# EAGLE design tb_project_ir_blaster_maxi_wemos_revA (EAGLE 7.6.0)
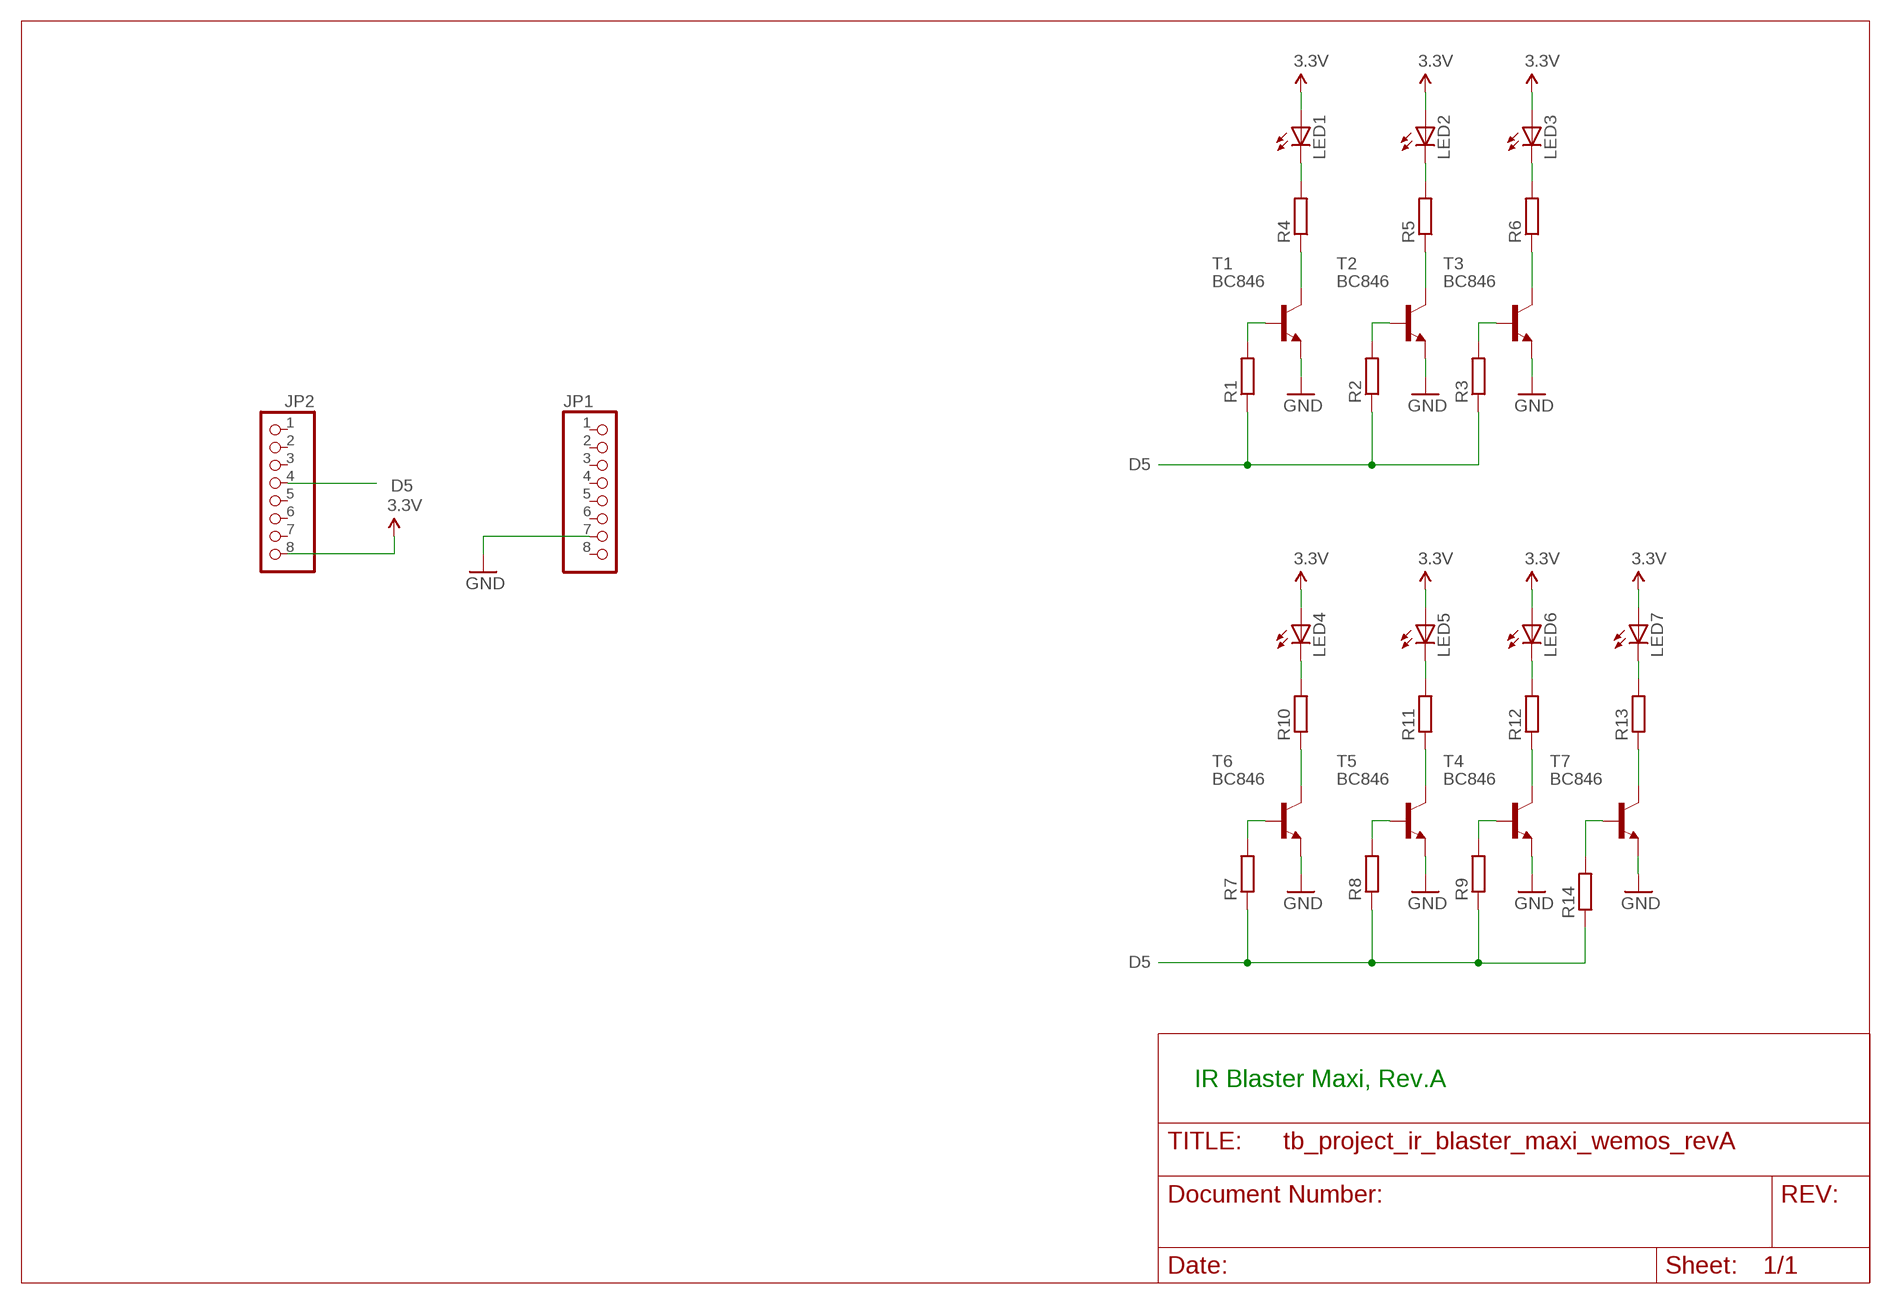
[diagram p0: schematic, sheet 1]

## Parts
JP1  PINHD-1X8  [1X08]
JP2  PINHD-1X8  [1X08]
LED1  LED5MM  [LED5MM]
LED2  LED5MM  [LED5MM]
LED3  LED5MM  [LED5MM]
LED4  LED5MM  [LED5MM]
LED5  LED5MM  [LED5MM]
LED6  LED5MM  [LED5MM]
LED7  LED5MM  [LED5MM]
R1  R-EU_R1206  [R1206]
R2  R-EU_R1206  [R1206]
R3  R-EU_R1206  [R1206]
R4  R-EU_R1206  [R1206]
R5  R-EU_R1206  [R1206]
R6  R-EU_R1206  [R1206]
R7  R-EU_R1206  [R1206]
R8  R-EU_R1206  [R1206]
R9  R-EU_R1206  [R1206]
R10  R-EU_R1206  [R1206]
R11  R-EU_R1206  [R1206]
R12  R-EU_R1206  [R1206]
R13  R-EU_R1206  [R1206]
R14  R-EU_R1206  [R1206]
T1  BC846  [SOT23]
T2  BC846  [SOT23]
T3  BC846  [SOT23]
T4  BC846  [SOT23]
T5  BC846  [SOT23]
T6  BC846  [SOT23]
T7  BC846  [SOT23]

## Nets
3.3V: JP2.8 LED1.A LED2.A LED3.A LED4.A LED5.A LED6.A LED7.A
D5: JP2.4 R1.1 R2.1 R3.1 R7.1 R8.1 R9.1 R14.1
GND: JP1.7 T1.2(E) T2.2(E) T3.2(E) T4.2(E) T5.2(E) T6.2(E) T7.2(E)
N$1: LED4.K(C) R10.2
N$2: LED1.K(C) R4.2
N$3: LED2.K(C) R5.2
N$4: LED3.K(C) R6.2
N$5: R4.1 T1.3(C)
N$6: R5.1 T2.3(C)
N$7: R6.1 T3.3(C)
N$8: R1.2 T1.1(B)
N$9: R2.2 T2.1(B)
N$10: R3.2 T3.1(B)
N$11: LED5.K(C) R11.2
N$12: LED6.K(C) R12.2
N$13: R10.1 T6.3(C)
N$14: R11.1 T5.3(C)
N$15: R12.1 T4.3(C)
N$16: R7.2 T6.1(B)
N$17: R8.2 T5.1(B)
N$18: R9.2 T4.1(B)
N$19: LED7.K(C) R13.2
N$20: R13.1 T7.3(C)
N$21: R14.2 T7.1(B)
Unconnected: JP1.1 JP1.2 JP1.3 JP1.4 JP1.5 JP1.6 JP1.8 JP2.1 JP2.2 JP2.3 JP2.5 JP2.6 JP2.7

## Notes on the sheet
- IR Blaster Maxi, Rev.A

## Library data of the parts
JP1 JP2 = pinhead:PINHD-1X8: PIN HEADER
LED1-LED7 = led:LED: LED OSRAM: - CHIPLED LG R971, LG N971, LY N971, LG Q971, LY Q971, LO R971, LY R971 LH N974, LH R974 LS Q976, LO Q976, LY Q976 LO Q996 - Hyper CHIPLED LW Q18S LB Q993, LB Q99A, LB R99A - SideLED LS A670, LO A670, LY A670, LG A670, LP A670 LB A673, LV A673, LT A673, LW A673 LH A674 LY A675 LS A676, LA A676, LO A676, LY A676, LW A676 LS A679, LY A679, LG A679 - Hyper Micro SIDELED® LS Y876, LA Y876, LO Y876, LY Y876 LT Y87S - SmartLED LW L88C, LW L88S LB L89C, LB L89S, LG L890 LS L89K, LO L89K, LY L89K LS L896, LA L896, LO L896, LY L896 - TOPLED LS T670, LO T670, LY T670, LG T670, LP T670 LSG T670, LSP T670, LSY T670, LOP T670, LYG T670 LG T671, LOG T671, LSG T671 LB T673, LV T673, LT T673, LW T673 LH T674 LS T676, LA T676, LO T676, LY T676, LB T676, LH T676, LSB T676, LW T676 LB T67C, LV T67C, LT T67C, LS T67K, LO T67K, LY T67K, LW E67C LS E67B, LA E67B, LO E67B, LY E67B, LB E67C, LV E67C, LT E67C LW T67C LS T679, LY T679, LG T679 LS T770, LO T770, LY T770, LG T770, LP T770 LB T773, LV T773, LT T773, LW T773 LH T774 LS E675, LA E675, LY E675, LS T675 LS T776, LA T776, LO T776, LY T776, LB T776 LHGB T686 LT T68C, LB T68C - Hyper Mini TOPLED® LB M676 - Mini TOPLED Santana® LG M470 LS M47K, LO M47K, LY M47K Source: http://www.osram.convergy.de LUXEON: - LUMILED® LXK2-PW12-R00, LXK2-PW12-S00, LXK2-PW14-U00, LXK2-PW14-V00 LXK2-PM12-R00, LXK2-PM12-S00, LXK2-PM14-U00 LXK2-PE12-Q00, LXK2-PE12-R00, LXK2-PE12-S00, LXK2-PE14-T00, LXK2-PE14-U00 LXK2-PB12-K00, LXK2-PB12-L00, LXK2-PB12-M00, LXK2-PB14-N00, LXK2-PB14-P00, LXK2-PB14-Q00 LXK2-PR12-L00, LXK2-PR12-M00, LXK2-PR14-Q00, LXK2-PR14-R00 LXK2-PD12-Q00, LXK2-PD12-R00, LXK2-PD12-S00 LXK2-PH12-R00, LXK2-PH12-S00 LXK2-PL12-P00, LXK2-PL12-Q00, LXK2-PL12-R00 Source: www.luxeon.com KINGBRIGHT: KA-3528ASYC Source: www.kingbright.com
R1-R14 = resistor:R-EU_: RESISTOR, European symbol
T1-T7 = transistor-neu-to92:BC846: NPN TRANSISTOR

## Net classes
0 default: width 0.203 mm, drill 0.356 mm, clearance 0.152 mm

## Board
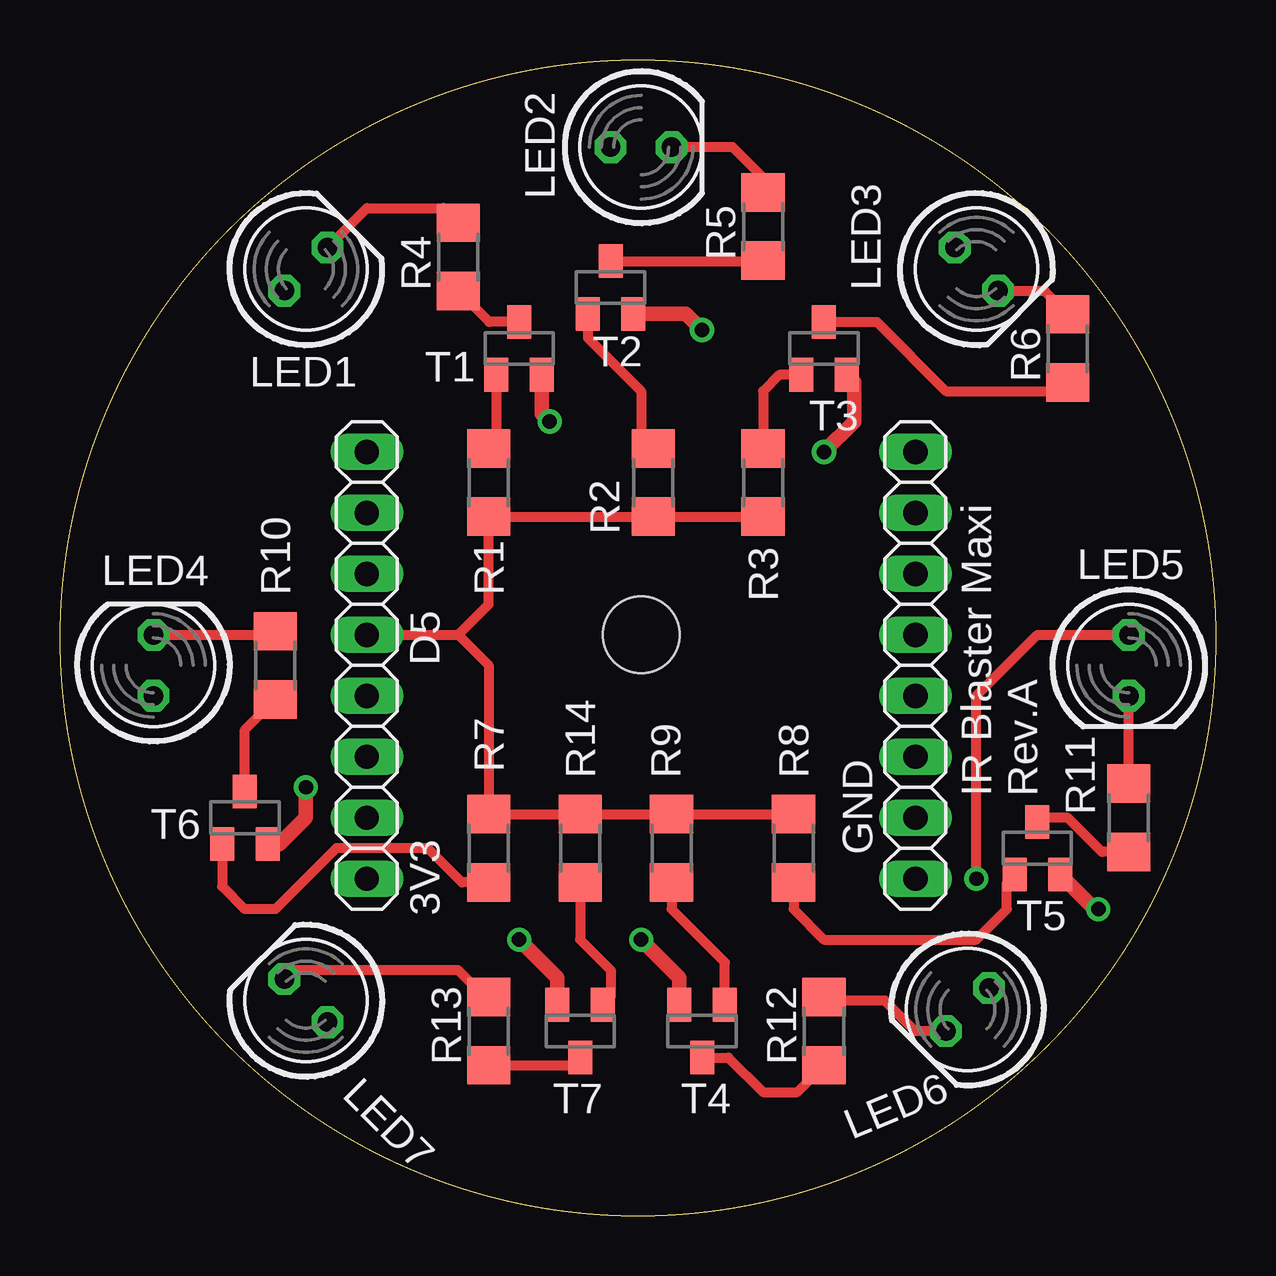
[diagram p1: board, top side]
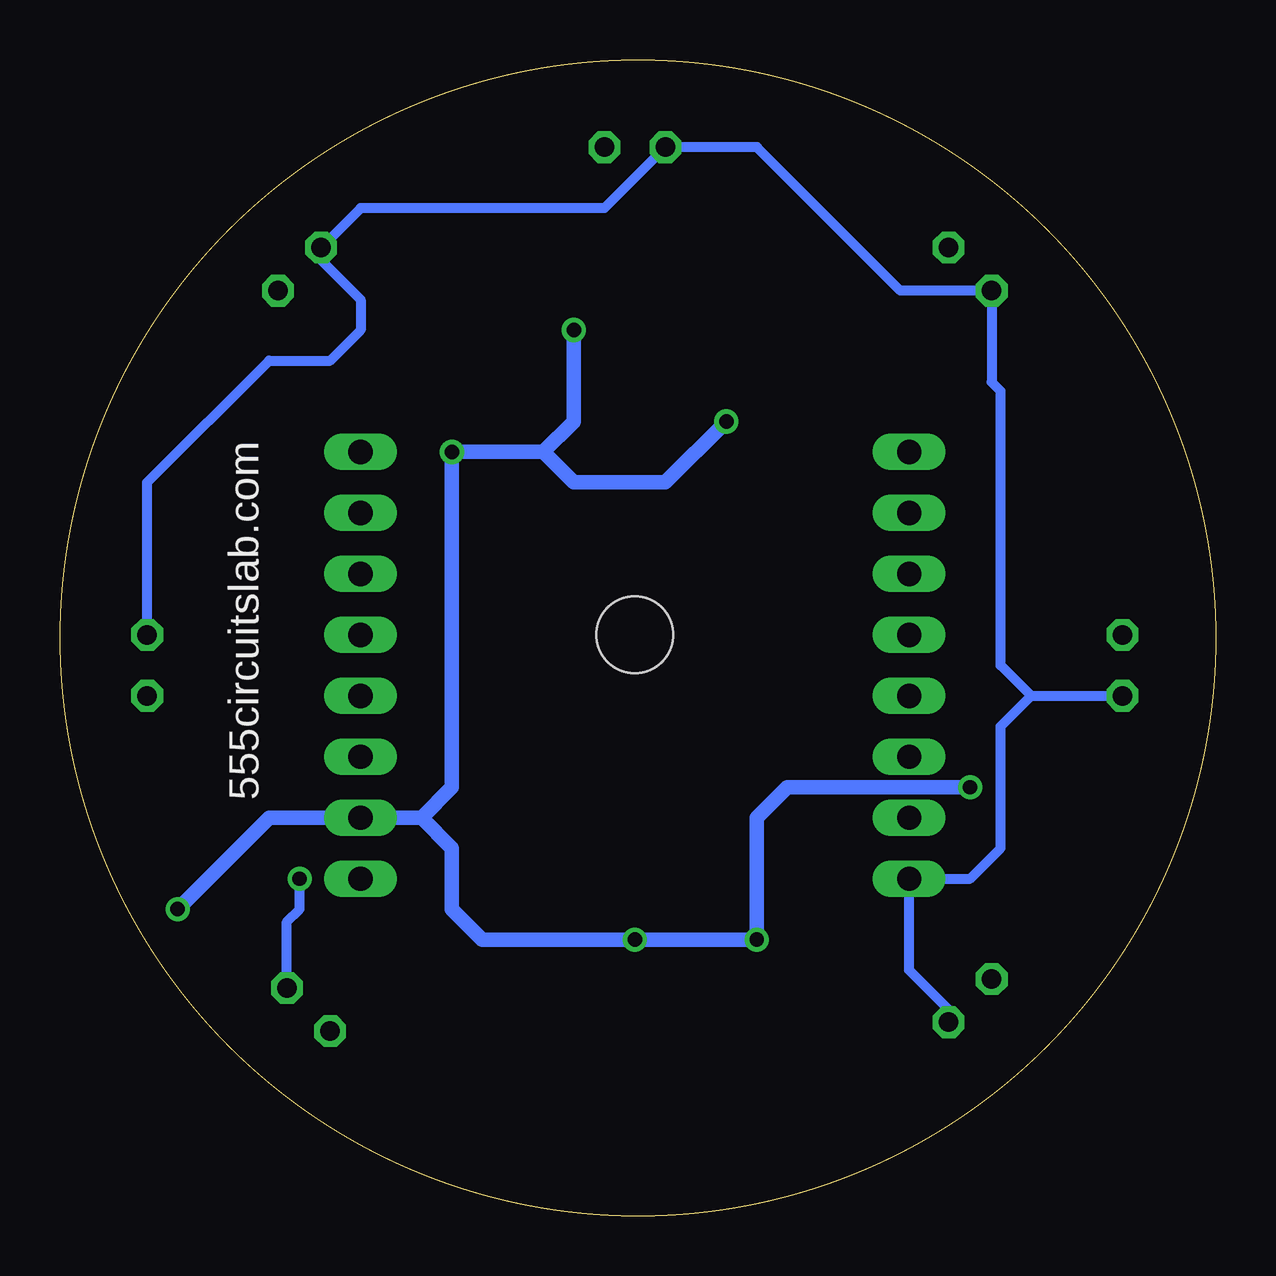
[diagram p2: board, bottom side, seen from below]

Size 48.17 x 48.17 mm. Coordinates in mm from the lower left corner, seen from the top.
Outline: circle at 24.08,24.08 radius 24.08
Copper layers (1*16): Top 0.035mm / dielectric 1.5mm / Bottom 0.035mm
Design rules "default": minimum track width 10mil, minimum drill 24mil, track to track 8mil, track to pad 8mil, pad to pad 8mil, via to via 8mil, smd to smd 8mil, copper to edge 40mil, drill to drill 8mil, minimum pad ring 10mil, minimum via ring 8mil, stop-mask expansion 4mil, vias tented up to drill 0mil, thermal gap 10mil
Holes 3.2 mm at 24.21,24.21

### Footprints (pad centres in the part's own frame; a part is rotated, then mirrored left to right if it is on the bottom)
1X08 = drill 1.016 long: 1 -8.89,0; 2 -6.35,0; 3 -3.81,0; 4 -1.27,0; 5 1.27,0; 6 3.81,0; 7 6.35,0; 8 8.89,0
LED5MM = drill 0.813 octagon: A -1.27,0; K 1.27,0
R1206 = smd 1.6 x 1.803: 1 -1.422,0; 2 1.422,0
SOT23 = smd 1 x 1.4: 1 -0.95,-1.1; 2 0.95,-1.1; 3 0,1.1

### Placement (x,y rotation side)
JP1  35.64,22.94 270 top
JP2  12.78,22.94 270 top
LED1  10.24,39.45 45 top
LED2  24.21,44.53 0 top
LED3  38.18,39.45 315 top
LED4  3.89,22.94 90 top
LED5  44.53,22.94 270 top
LED6  37.81,8.6 225 top
LED7  10.24,8.97 135 top
R1  17.86,30.56 90 top
R2  24.72,30.56 90 top
R3  29.29,30.56 90 top
R4  16.59,39.96 90 top
R5  29.29,41.23 90 top
R6  41.99,36.15 90 top
R7  17.86,15.32 270 top
R8  30.56,15.32 270 top
R9  25.48,15.32 270 top
R10  8.97,22.94 90 top
R11  44.53,16.59 90 top
R12  31.83,7.7 90 top
R13  17.86,7.7 90 top
R14  21.67,15.32 270 top
T1  19.13,36.15 0 top
T2  22.94,38.69 0 top
T3  31.83,36.15 0 top
T4  26.75,7.7 180 top
T5  40.72,15.32 0 top
T6  7.7,16.59 0 top
T7  21.67,7.7 180 top

### Tracks (layer width: path | path; a pad name or v marks a point on that pad's centre or on a via)
3.3V  (via drill 0.6)
  Top 0.406: v38.18,14.05 38.18,21.67 40.72,24.21 LED5.A
  Bottom 0.406: LED7.A 11.14,8.6 12.78,10.24 JP2.8 10.24,14.05 8.97,15.32 8.97,20.4 7.7,21.67 | 7.7,21.67 LED4.A | 7.7,21.67 8.97,22.94 8.97,34.37 9.35,34.75 LED1.A 13.16,38.56 19.13,44.53 LED2.A 25.48,41.99 35.64,41.99 LED3.A 37.29,39.83 35.64,38.18 35.64,36.91 36.91,35.64 39.45,35.64 44.53,30.56 LED5.A | LED6.A 38.71,12.26 38.18,12.78 v38.18,14.05
D5
  Top 0.406: JP2.4 16.59,24.21 | 16.59,24.21 17.86,25.48 R1.1 R2.1 R3.1 | 16.59,24.21 17.86,22.94 R7.1 R14.1 R9.1 R8.1
GND  (via drill 0.6)
  Top 0.61: v31.83,31.83 33.1,33.1 33.1,34.73 T3.2 | T2.2 26.08,37.59 v26.75,36.91 | T1.2 20.08,33.42 v20.4,33.1 | T7.2 20.72,9.92 v19.13,11.51 | v10.24,17.86 10.24,16.59 9.14,15.49 T6.2 | T4.2 25.8,9.92 v24.21,11.51 | v43.26,12.78 43.11,12.78 T5.2
  Bottom 0.61: 33.1,16.59 JP1.7 39.45,16.59 v43.26,12.78 | 33.1,16.59 31.83,17.86 v31.83,31.83 28.02,31.83 | v26.75,36.91 26.75,33.1 28.02,31.83 | v20.4,33.1 22.94,30.56 26.75,30.56 28.02,31.83 | v10.24,17.86 17.86,17.86 19.13,16.59 v19.13,11.51 v24.21,11.51 30.56,11.51 31.83,12.78 31.83,15.32 33.1,16.59
N$1
  Top 0.406: LED4.K 8.82,24.21 R10.2
N$2
  Top 0.406: LED1.K 12.78,41.99 15.98,41.99 R4.2
N$3
  Top 0.406: R5.2 29.29,43.26 28.02,44.53 LED2.K
N$4
  Top 0.406: LED3.K 41.01,38.56 R6.2
N$5
  Top 0.406: T1.3 17.88,37.25 R4.1
N$6
  Top 0.406: T2.3 29.28,39.79 R5.1
N$7
  Top 0.406: T3.3 34.04,37.25 36.91,34.37 41.64,34.37 R6.1
N$8
  Top 0.406: T1.1 18.18,32.31 R1.2
N$9
  Top 0.406: T2.1 21.99,36.59 24.21,34.37 24.21,32.49 R2.2
N$10
  Top 0.406: T3.1 29.97,35.05 29.29,34.37 R3.2
N$11
  Top 0.406: R11.2 LED5.K
N$12
  Top 0.406: LED6.K 35.64,7.7 34.37,8.97 31.99,8.97 R12.2
N$13
  Top 0.406: T6.3 7.7,20.25 R10.1
N$14
  Top 0.406: R11.1 43.42,15.17 41.99,16.59 40.89,16.59 T5.3
N$15
  Top 0.406: T4.3 27.85,6.6 29.29,5.16 30.72,5.16 R12.1
N$16
  Top 0.406: R7.2 16.75,13.9 15.32,15.32 11.51,15.32 8.97,12.78 7.7,12.78 6.75,13.73 T6.1
N$17
  Top 0.406: R8.2 30.56,12.78 31.83,11.51 38.18,11.51 39.45,12.78 39.45,13.9 T5.1
N$18
  Top 0.406: R9.2 25.48,12.78 27.7,10.56 T4.1
N$19
  Top 0.406: R13.2 17.71,9.13 16.59,10.24 9.72,10.24 LED7.K
N$20
  Top 0.406: R13.1 21.35,6.28 T7.3
N$21
  Top 0.406: R14.2 21.67,11.51 22.94,10.24 22.94,9.12 T7.1

### Text on the board
tPlace: D5 | IR Blaster Maxi / Rev.A | GND | 3V3
bPlace: 555circuitslab.com